# Altium schematic sheet Power.SchDoc
size A4
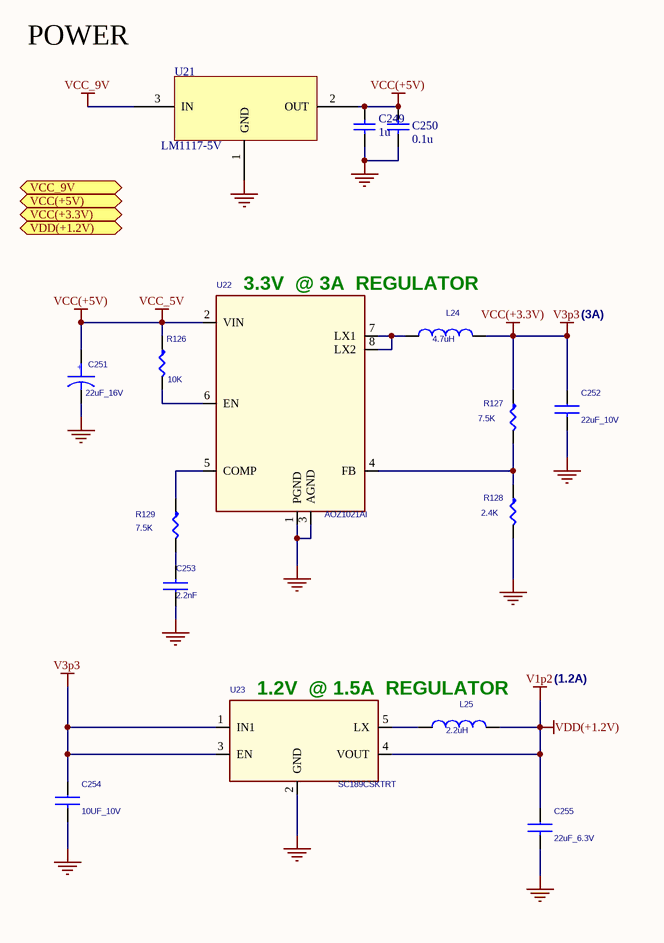
[diagram p0: Power.SchDoc]

## Parts
C249  1u  [C0603]
C250  0.1u  [C0603]
C251  22uF_16V  [CAPCP3216X100M]
C252  22uF_10V  [CAPC3216X100M]
C253  2.2nF  [CAPC2112X70M]
C254  10UF_10V  [CAPC2012X145M]
C255  22uF_6.3V  [CAPC3216X100M]
L24  4.7uH  [IND_NR6028T4R7M]
L25  2.2uH  [INDP3225X240M]
R126  10K  [RESC1608X55M]
R127  7.5K  [RESC1608X55M]
R128  2.4K  [RESC1608X55M]
R129  7.5K  [RESC1608X55M]
U21  LM1117-5V  [SOT-223]
U22  AOZ1021AI  [SOIC127P600X175-8M]
U23  SC189CSKTRT  [SOT95P280X145-5M]

## Ports
VCC(+3.3V) (bidir), VCC(+5V) (bidir), VCC_9V (in), VDD(+1.2V) (bidir)

## Nets
GND: C249.1 C250.2 C251.2 C252.2 C253.1 C254.2 C255.2 R128.2 U21.1(GND) U22.1(PGND) U22.3(AGND) U23.2(GND)
V1p2: C255.1 L25.2 U23.4(VOUT)  [also labelled VDD(+1.2V)]
V3p3: C252.1 C254.1 L24.2 R127.1 U23.1(IN1) U23.3(EN)  [also labelled VCC(+3.3V)]
VCC(+5V): C249.2 C250.1 C251.1 R126.1 U21.2(OUT) U22.2(VIN)  [also labelled VCC_5V]
VCC_9V: U21.3(IN)
NetC253_2: C253.2 R129.2
NetL24_1: L24.1 U22.7(LX1) U22.8(LX2)
NetL25_1: L25.1 U23.5(LX)
NetR126_2: R126.2 U22.6(EN)
NetR127_2: R127.2 R128.1 U22.4(FB)
NetR129_1: R129.1 U22.5(COMP)

## Notes on the sheet
- POWER
- 3.3V  @ 3A  REGULATOR
- (3A)
- 1.2V  @ 1.5A  REGULATOR
- (1.2A)
- (in symbol CAP POL) +

## Library data of the parts
C249 = Cap: 50V/8.2u/0805; Value: 100n; Published: 8-Jun-2000; LatestRevisionDate: 17-Jul-2002; LatestRevisionNote: Re-released for DXP Platform.; PackageReference: RAD-0.3; Publisher: Altium Limited
C250 = CAP0805: Capacitor; Value: 104; Published: 8-Jun-2000; Revision: July-2002: Re-released for DXP Platform.; Publisher: Altium Limited
C251 = CAP POL: CAP TANT 22UF 16V 10% 1206; Manufacturer: Nichicon; Part Number: F951C226KQAAQ2; RoHS Compliant: Yes; Lead Free Status: No
C252 C254 C255 = CAPACITOR NON-POL: Manufacturer: *; Part Number: *
C253 = CAPACITOR NON-POL: CAP CER 2200PF 50V 10% X7R 0805; Manufacturer: Yageo; Part Number: CC0805KRX7R9BB222; Num Pins: 2; RoHS Compliant: Yes; Lead Free: YES
L24 = INDUCTOR: INDUCTOR 4.7UH 2.7A 20% SMD; Part Number: NR6028T4R7M; Manufacturer: Taiyo Yuden; Lead Free: YES
L25 = INDUCTOR: INDUCTOR 2.2UH 1.20A 20% 1210; Part Number: NLCV32T-2R2M-PFR; Manufacturer: TDK Corporation; Lead Free: YES
R126 = R_Dup1: RES 10.0K OHM 1/10W 1% 0603 SMD; Manufacturer: Panasonic - ECG; Part Number: ERJ-3EKF1002V; Lead Free: YES
R127 = R_Dup1: RES 7.5K OHM 1/10W 1% 0603 SMD; Manufacturer: Panasonic - ECG; Part Number: ERJ-3EKF7501V; Lead Free: YES
R128 = R_Dup1: RES 2.4K OHM 1/10W 1% 0603 SMD; Manufacturer: Panasonic - ECG; Part Number: ERJ-3EKF2401V; Lead Free: YES
R129 = R_Dup1: RES 7.5K OHM 1/10W 1% 0603 SMD; Part Number: ERJ-3EKF7501V; Manufacturer: Panasonic - ECG; Lead Free: YES
U21 = AMS1117
U22 = AOZ1021AI: IC REG BUCK SYNC ADJ 3A 8SOIC; Manufacturer: Alpha & Omega Semiconductor Inc; Part Number: AOZ1021AI
U23 = SC189CSKTRT: IC REG BUCK SYNC 1.2V SOT23-5; Manufacturer: Semtech; Part Number: SC189CSKTRT